# EAGLE schematic sp6641 (EAGLE 6.2)
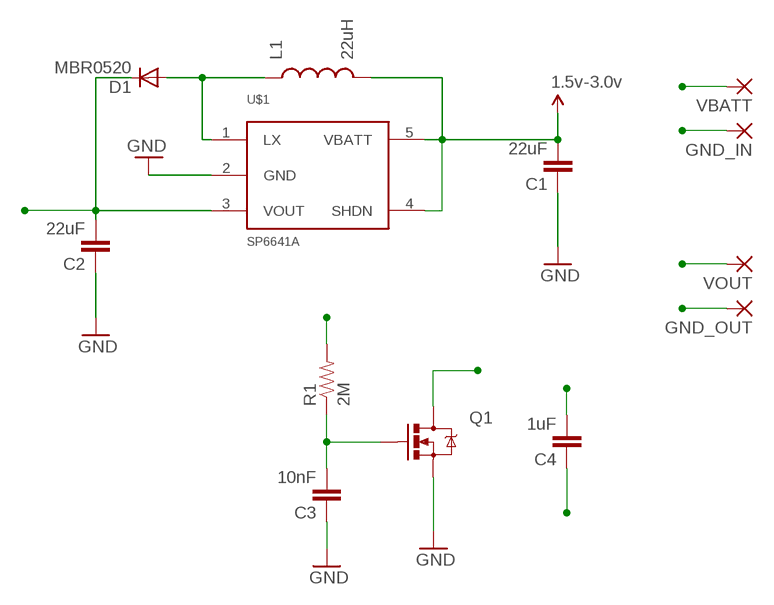
[diagram p0: schematic, sheet 1]

## Parts
C1  22uF  CAP0805  [0805]
C2  22uF  CAP0805  [0805]
C3  10nF  CAP0805  [0805]
C4  1uF  CAP1206  [1206]
D1  MBR0520  MBR0520LT  [SOD123]
GND_IN  WIREPAD2,54/1,0  [2,54/1,0]
GND_OUT  WIREPAD2,54/1,0  [2,54/1,0]
L1  22uH  INDUCTORCR54  [CR54]
Q1  MOSFET-NCHANNELSMD  [SOT23-3]
R1  2M  RESISTOR0805-RES  [0805]
U$1  SP6641A  SP6641SP6641A/B  [SOT23-5]
VBATT  WIREPAD2,54/1,0  [2,54/1,0]
VOUT  WIREPAD2,54/1,0  [2,54/1,0]

## Nets
GND: C1.1 C2.1 C3.1 GND_IN.1(P) Q1.2(S) U$1.2(GND)
GND_OUT: C4.1 GND_OUT.1(P) Q1.3(D)
N$2: C3.2 Q1.1(G) R1.1
N$3: D1.A L1.P$1 U$1.1(LX)
VBATT: C1.2 L1.P$2 U$1.4(SHDN) U$1.5(VBATT) VBATT.1(P) ; supply symbol labelled 1.5v-3.0v
VOUT: C2.2 C4.2 D1.C R1.2 U$1.3(VOUT) VOUT.1(P)

## Library data of the parts
C1-C4 = SparkFun:CAP: Capacitor Standard 0603 ceramic capacitor, and 0.1" leaded capacitor.
D1 = diode:MBR0520LT: SCHOTTKY BARRIER RECTIFIER Source: http://onsemi.com .. MBR0520LT1-D.pdf
GND_IN GND_OUT VBATT VOUT = wirepad:WIREPAD: Wire PAD connect wire on PCB
L1 = SparkFun:INDUCTOR: Inductors Basic Inductor/Choke - 0603 and 1206. Footprints are not proven and vary greatly between part numbers.
Q1 = SparkFun:MOSFET-NCHANNEL
R1 = SparkFun:RESISTOR: Resistor Basic schematic elements and footprints for 0603, 1206, and PTH resistors.
U$1 = Sipex Custom:SP6641